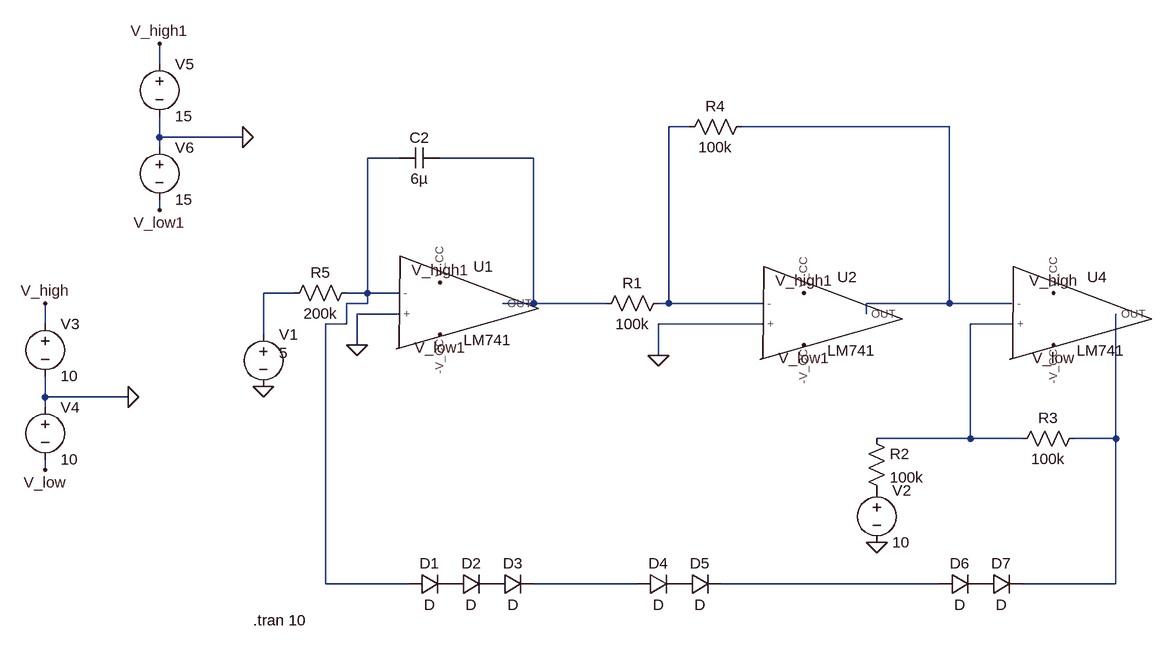
[diagram p0: schematic VCO_Diode.asc]
VCO_Diode.asc, the LTspice schematic file:
Version 4.1
SHEET 1 1196 680
WIRE -336 -272 -336 -304
WIRE 480 -176 448 -176
WIRE 880 -176 560 -176
WIRE -336 -160 -336 -192
WIRE -208 -160 -336 -160
WIRE -336 -144 -336 -160
WIRE 32 -128 -16 -128
WIRE 240 -128 96 -128
WIRE -336 -48 -336 -64
WIRE -128 80 -176 80
WIRE -16 80 -16 -128
WIRE -16 80 -48 80
WIRE 32 80 -16 80
WIRE -16 96 -16 80
WIRE -16 96 -48 96
WIRE 240 96 240 -128
WIRE 240 96 192 96
WIRE 352 96 240 96
WIRE 448 96 448 -176
WIRE 448 96 432 96
WIRE 592 96 448 96
WIRE 880 96 880 -176
WIRE 880 96 752 96
WIRE 976 96 880 96
WIRE 32 112 -32 112
WIRE 752 112 752 96
WIRE -512 128 -512 96
WIRE -48 128 -48 96
WIRE -48 128 -80 128
WIRE 592 128 432 128
WIRE 976 128 912 128
WIRE -176 144 -176 80
WIRE -32 160 -32 112
WIRE 432 176 432 128
WIRE -512 240 -512 208
WIRE -384 240 -512 240
WIRE -512 256 -512 240
WIRE 912 304 912 128
WIRE 912 304 768 304
WIRE 992 304 912 304
WIRE 1136 304 1136 112
WIRE 1136 304 1072 304
WIRE -512 352 -512 336
WIRE -80 528 -80 128
WIRE 48 528 -80 528
WIRE 400 528 240 528
WIRE 864 528 528 528
WIRE 1136 528 1136 304
WIRE 1136 528 992 528
FLAG -176 224 0
FLAG 768 464 0
FLAG -384 240 0
FLAG -512 96 V_high
FLAG -512 352 V_low
FLAG 1040 80 V_high
FLAG 96 64 V_high1
FLAG 1040 160 V_low
FLAG 96 144 V_low1
FLAG -32 160 0
FLAG 432 176 0
FLAG 656 80 V_high1
FLAG 656 160 V_low1
FLAG -208 -160 0
FLAG -336 -304 V_high1
FLAG -336 -48 V_low1
SYMBOL res 752 288 R0
SYMATTR InstName R2
SYMATTR Value 100k
SYMBOL res 1088 288 R90
WINDOW 0 0 56 VBottom 2
WINDOW 3 32 56 VTop 2
SYMATTR InstName R3
SYMATTR Value 100k
SYMBOL res -32 64 R90
WINDOW 0 0 56 VBottom 2
WINDOW 3 32 56 VTop 2
SYMATTR InstName R5
SYMATTR Value 200k
SYMBOL cap 96 -144 R90
WINDOW 0 0 32 VBottom 2
WINDOW 3 32 32 VTop 2
SYMATTR InstName C2
SYMATTR Value 6µ
SYMBOL voltage -176 128 R0
WINDOW 3 24 44 Left 2
WINDOW 123 0 0 Left 0
WINDOW 39 0 0 Left 0
SYMATTR Value 5
SYMATTR InstName V1
SYMBOL voltage 768 368 R0
WINDOW 123 0 0 Left 0
WINDOW 39 0 0 Left 0
SYMATTR InstName V2
SYMATTR Value 10
SYMBOL diode 48 544 R270
WINDOW 0 32 32 VTop 2
WINDOW 3 0 32 VBottom 2
SYMATTR InstName D1
SYMBOL diode 112 544 R270
WINDOW 0 32 32 VTop 2
WINDOW 3 0 32 VBottom 2
SYMATTR InstName D2
SYMBOL diode 176 544 R270
WINDOW 0 32 32 VTop 2
WINDOW 3 0 32 VBottom 2
SYMATTR InstName D3
SYMBOL diode 400 544 R270
WINDOW 0 32 32 VTop 2
WINDOW 3 0 32 VBottom 2
SYMATTR InstName D4
SYMBOL diode 464 544 R270
WINDOW 0 32 32 VTop 2
WINDOW 3 0 32 VBottom 2
SYMATTR InstName D5
SYMBOL diode 864 544 R270
WINDOW 0 32 32 VTop 2
WINDOW 3 0 32 VBottom 2
SYMATTR InstName D6
SYMBOL diode 928 544 R270
WINDOW 0 32 32 VTop 2
WINDOW 3 0 32 VBottom 2
SYMATTR InstName D7
SYMBOL voltage -512 112 R0
WINDOW 123 0 0 Left 0
WINDOW 39 0 0 Left 0
SYMATTR InstName V3
SYMATTR Value 10
SYMBOL voltage -512 240 R0
WINDOW 123 0 0 Left 0
WINDOW 39 0 0 Left 0
SYMATTR InstName V4
SYMATTR Value 10
SYMBOL res 448 80 R90
WINDOW 0 0 56 VBottom 2
WINDOW 3 32 56 VTop 2
SYMATTR InstName R1
SYMATTR Value 100k
SYMBOL res 576 -192 R90
WINDOW 0 0 56 VBottom 2
WINDOW 3 32 56 VTop 2
SYMATTR InstName R4
SYMATTR Value 100k
SYMBOL voltage -336 -288 R0
WINDOW 123 0 0 Left 0
WINDOW 39 0 0 Left 0
SYMATTR InstName V5
SYMATTR Value 15
SYMBOL voltage -336 -160 R0
WINDOW 123 0 0 Left 0
WINDOW 39 0 0 Left 0
SYMATTR InstName V6
SYMATTR Value 15
SYMBOL LM741 1040 112 R0
SYMATTR InstName U4
SYMBOL LM741 656 112 R0
SYMATTR InstName U2
SYMBOL LM741 96 96 R0
SYMATTR InstName U1
TEXT -192 584 Left 2 !.tran 10

The netlist it stands for:
* VCO_Diode.asc
R2 N006 P001 100k
R3 N007 N006 100k
R5 N003 N005 200k
C2 N004 N003 6µ
V1 N005 0 5
V2 P001 0 10
D1 N003 P002 D
D2 P002 P003 D
D3 P003 N008 D
D4 N008 P004 D
D5 P004 N009 D
D6 N009 P005 D
D7 P005 N007 D
V3 V_high 0 10
V4 0 V_low 10
R1 N001 N004 100k
R4 N002 N001 100k
V5 V_high1 0 15
V6 0 V_low1 15
X§U4 N006 N002 V_high V_low N007 LM741  ; pins + - V_CC -V_CC OUT
X§U2 0 N001 V_high1 V_low1 N002 LM741  ; pins + - V_CC -V_CC OUT
X§U1 0 N003 V_high1 V_low1 N004 LM741  ; pins + - V_CC -V_CC OUT
.model D D
.lib standard.dio
.tran 10
.lib F:\DOWNLOADS\snom211b\lm741.lib
.backanno
.end